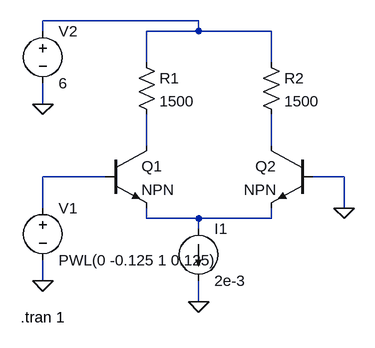
[diagram p0: schematic celda_gillbert.asc]
celda_gillbert.asc, the LTspice schematic file:
Version 4
SHEET 1 880 716
WIRE 160 16 -80 16
WIRE -80 32 -80 16
WIRE 160 32 160 16
WIRE 160 32 80 32
WIRE 272 32 160 32
WIRE 80 80 80 32
WIRE 272 80 272 32
WIRE -80 144 -80 112
WIRE 80 208 80 160
WIRE 272 208 272 160
WIRE 16 256 -80 256
WIRE 384 256 336 256
WIRE -80 304 -80 256
WIRE 384 304 384 256
WIRE 80 320 80 304
WIRE 160 320 80 320
WIRE 272 320 272 304
WIRE 272 320 160 320
WIRE 160 336 160 320
WIRE -80 416 -80 384
WIRE 160 448 160 416
FLAG 160 448 0
FLAG -80 416 0
FLAG 384 304 0
FLAG -80 144 0
SYMBOL res 64 64 R0
SYMATTR InstName R1
SYMATTR Value 1500
SYMBOL res 256 64 R0
SYMATTR InstName R2
SYMATTR Value 1500
SYMBOL npn 16 208 R0
SYMATTR InstName Q1
SYMBOL npn 336 208 M0
SYMATTR InstName Q2
SYMBOL current 160 336 R0
WINDOW 123 0 0 Left 0
WINDOW 39 0 0 Left 0
SYMATTR InstName I1
SYMATTR Value 2e-3
SYMBOL voltage -80 288 R0
WINDOW 123 0 0 Left 0
WINDOW 39 0 0 Left 0
SYMATTR InstName V1
SYMATTR Value PWL(0 -0.125 1 0.125)
SYMBOL voltage -80 16 R0
WINDOW 123 0 0 Left 0
WINDOW 39 0 0 Left 0
SYMATTR InstName V2
SYMATTR Value 6
TEXT -114 472 Left 2 !.tran 1

The netlist it stands for:
* celda_gillbert.asc
R1 N001 N002 1500
R2 N001 N003 1500
Q1 N002 N004 N005 0 NPN
Q2 N003 0 N005 0 NPN
I1 N005 0 2e-3
V1 N004 0 PWL(0 -0.125 1 0.125)
V2 N001 0 6
.model NPN NPN
.model PNP PNP
.lib standard.bjt
.tran 1
.backanno
.end